# Altium schematic sheet Top.SchDoc
size A4
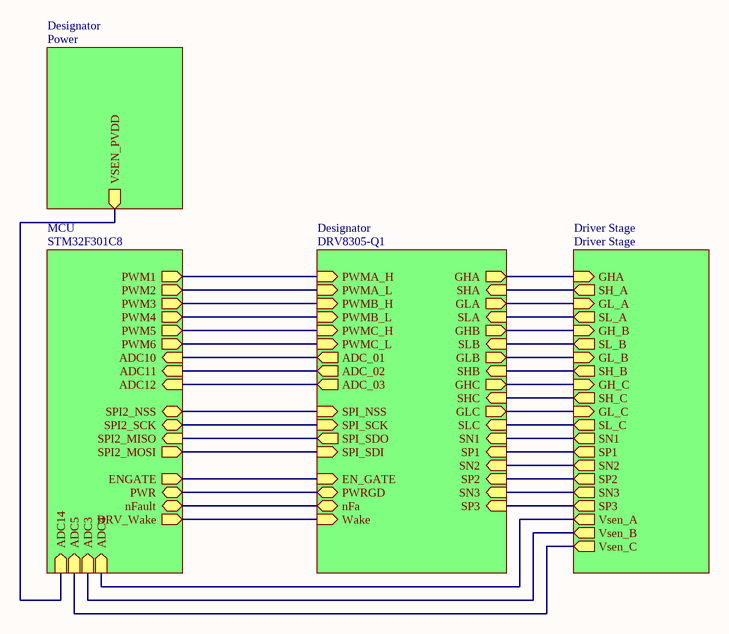
[diagram p0: Top.SchDoc]

## Sub-sheets
Designator = DRV8305-Q1: SPI_SCK (in), SPI_SDI (in), SPI_SDO (out), SPI_NSS (in), PWMA_H (in), PWMA_L (in), PWMB_H (in), PWMB_L (in), PWMC_H (in), PWMC_L (in), ADC_01 (out), ADC_02 (out), ADC_03 (out), nFa, EN_GATE (in), GHA (out), SHA (in), GLA (out), SLA (in), GHB (out), SLB (in), GLB (out), SHB (in), GHC (out), SHC (in), GLC (out), SLC (in), PWRGD (bidir), Wake (in), SN1 (in), SP1 (in), SN2 (in), SP2 (in), SN3 (in), SP3 (in)
Designator = Power: VSEN_PVDD (out)
Driver Stage = Driver Stage: GH_B (in), SH_B (out), GL_B (in), SL_B (out), GHA (in), SH_A (out), GL_A (in), SL_A (out), SL_C (out), GL_C (in), SH_C (out), GH_C (in), Vsen_C (out), Vsen_B (out), Vsen_A (out), SN1 (out), SP1 (out), SN2 (out), SP2 (out), SN3 (out), SP3 (out)
MCU = STM32F301C8: PWM1 (out), PWM2 (out), PWM3 (out), PWM4 (out), PWM5 (out), PWM6 (out), ADC10 (in), ADC11 (in), ADC12 (in), SPI2_NSS (bidir), SPI2_SCK (bidir), ADC4 (in), ADC3 (in), ADC5 (in), ADC14 (in), nFault (bidir), ENGATE (out), SPI2_MISO (in), SPI2_MOSI (out), PWR, DRV_Wake (out)

## Nets
(unnamed): sheet MCU/PWM1, sheet Designator/PWMA_H
(unnamed): sheet MCU/PWM2, sheet Designator/PWMA_L
(unnamed): sheet MCU/PWM3, sheet Designator/PWMB_H
(unnamed): sheet MCU/PWM4, sheet Designator/PWMB_L
(unnamed): sheet MCU/PWM5, sheet Designator/PWMC_H
(unnamed): sheet MCU/PWM6, sheet Designator/PWMC_L
(unnamed): sheet MCU/ADC10, sheet Designator/ADC_01
(unnamed): sheet MCU/ADC11, sheet Designator/ADC_02
(unnamed): sheet MCU/ADC12, sheet Designator/ADC_03
(unnamed): sheet MCU/SPI2_NSS, sheet Designator/SPI_NSS
(unnamed): sheet MCU/SPI2_SCK, sheet Designator/SPI_SCK
(unnamed): sheet MCU/ADC4, sheet Driver Stage/Vsen_A
(unnamed): sheet MCU/ADC3, sheet Driver Stage/Vsen_B
(unnamed): sheet MCU/ADC5, sheet Driver Stage/Vsen_C
(unnamed): sheet MCU/ADC14, sheet Designator/VSEN_PVDD
(unnamed): sheet MCU/nFault, sheet Designator/nFa
(unnamed): sheet MCU/ENGATE, sheet Designator/EN_GATE
(unnamed): sheet MCU/SPI2_MISO, sheet Designator/SPI_SDO
(unnamed): sheet MCU/SPI2_MOSI, sheet Designator/SPI_SDI
(unnamed): sheet MCU/PWR, sheet Designator/PWRGD
(unnamed): sheet MCU/DRV_Wake, sheet Designator/Wake
(unnamed): sheet Designator/GHA, sheet Driver Stage/GHA
(unnamed): sheet Designator/SHA, sheet Driver Stage/SH_A
(unnamed): sheet Designator/GLA, sheet Driver Stage/GL_A
(unnamed): sheet Designator/SLA, sheet Driver Stage/SL_A
(unnamed): sheet Designator/GHB, sheet Driver Stage/GH_B
(unnamed): sheet Designator/SLB, sheet Driver Stage/SL_B
(unnamed): sheet Designator/GLB, sheet Driver Stage/GL_B
(unnamed): sheet Designator/SHB, sheet Driver Stage/SH_B
(unnamed): sheet Designator/GHC, sheet Driver Stage/GH_C
(unnamed): sheet Designator/SHC, sheet Driver Stage/SH_C
(unnamed): sheet Designator/GLC, sheet Driver Stage/GL_C
(unnamed): sheet Designator/SLC, sheet Driver Stage/SL_C
(unnamed): sheet Designator/SN1, sheet Driver Stage/SN1
(unnamed): sheet Designator/SP1, sheet Driver Stage/SP1
(unnamed): sheet Designator/SN2, sheet Driver Stage/SN2
(unnamed): sheet Designator/SP2, sheet Driver Stage/SP2
(unnamed): sheet Designator/SN3, sheet Driver Stage/SN3
(unnamed): sheet Designator/SP3, sheet Driver Stage/SP3